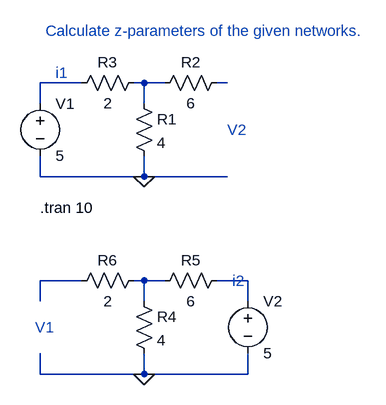
[diagram p0: schematic Lab6_ques1.asc]
Lab6_ques1.asc, the LTspice schematic file:
Version 4
SHEET 1 880 680
WIRE -64 144 -128 144
WIRE 32 144 16 144
WIRE 64 144 32 144
WIRE 160 144 144 144
WIRE -128 176 -128 144
WIRE 32 176 32 144
WIRE -128 288 -128 256
WIRE 32 288 32 256
WIRE 32 288 -128 288
WIRE 160 288 32 288
WIRE -64 448 -128 448
WIRE 32 448 16 448
WIRE 64 448 32 448
WIRE 192 448 144 448
WIRE -128 480 -128 448
WIRE 32 480 32 448
WIRE 192 480 192 448
WIRE -128 592 -128 560
WIRE 32 592 32 560
WIRE 32 592 -128 592
WIRE 192 592 192 560
WIRE 192 592 32 592
FLAG 32 288 0
FLAG 32 592 0
SYMBOL Res 16 160 R0
SYMATTR InstName R1
SYMATTR Value 4
SYMBOL Res 160 128 R90
WINDOW 0 0 56 VBottom 2
WINDOW 3 32 56 VTop 2
SYMATTR InstName R2
SYMATTR Value 6
SYMBOL Res 32 128 R90
WINDOW 0 0 56 VBottom 2
WINDOW 3 32 56 VTop 2
SYMATTR InstName R3
SYMATTR Value 2
SYMBOL Voltage -128 160 R0
SYMATTR InstName V1
SYMATTR Value 5
SYMBOL Res 16 464 R0
SYMATTR InstName R4
SYMATTR Value 4
SYMBOL Res 160 432 R90
WINDOW 0 0 56 VBottom 2
WINDOW 3 32 56 VTop 2
SYMATTR InstName R5
SYMATTR Value 6
SYMBOL Res 32 432 R90
WINDOW 0 0 56 VBottom 2
WINDOW 3 32 56 VTop 2
SYMATTR InstName R6
SYMATTR Value 2
SYMBOL Voltage 192 464 R0
SYMATTR InstName V2
SYMATTR Value 5
TEXT -120 64 Left 2 ;Calculate z-parameters of the given networks.
TEXT -104 128 Left 2 ;i1
TEXT -128 336 Left 2 !.tran 10
TEXT 168 448 Left 2 ;i2
TEXT -136 520 Left 2 ;V1
TEXT 160 216 Left 2 ;V2

The netlist it stands for:
* Lab6_ques1.asc
R1 N002 0 4
R2 N003 N002 6
R3 N002 N001 2
V1 N001 0 5
R4 N005 0 4
R5 N006 N005 6
R6 N005 N004 2
V2 N006 0 5
* Calculate z-parameters of the given networks.
* i1
.tran 10
* i2
* V1
* V2
.backanno
.end